# Altium schematic sheet Peripherals.SchDoc
size A3; Address1: ECE Department; Address2: University of Canterbury; Address3: Christchurch 8041; Address4: New Zealand; Revision: 1; SheetNumber: 2; SheetTotal: 3; ImagePath: \\maxwell\elecapp\AltiumDesigner\Templates\uc-logo.png
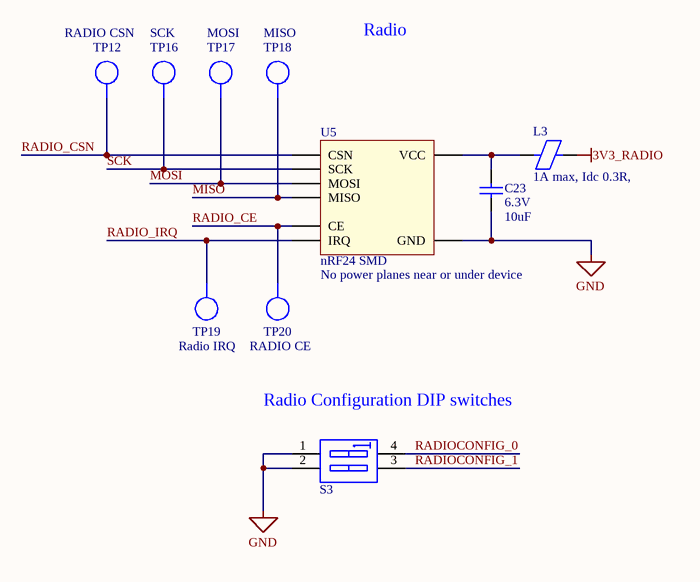
[diagram p0: Peripherals.SchDoc]

## Parts
C23  Voltage - Rated: 6.3V  [CAPC1608L]  (hidden comment: 10uF)
L3  1A max, Idc 0.3R,  [INDC3216L]
S3  WS_SW DIP-2  [DIP_SW_2WAY_SMD]  (value not drawn)
TP12  RADIO CSN  [TP_1206]  (no BOM)
TP16  SCK  [TP_1206]  (no BOM)
TP17  MOSI  [TP_1206]  (no BOM)
TP18  MISO  [TP_1206]  (no BOM)
TP19  Radio IRQ  [TP_1206]  (no BOM)
TP20  RADIO CE  [TP_1206]  (no BOM)
U5  nRF24 SMD  Warning: No power planes near or under device  [NRF24]

## Nets
3V3_RADIO: L3.2
GND: C23.1 S3.1(A1) S3.2(A2) U5.2(GND)
MISO: TP18.1 U5.7(MISO)
MOSI: TP17.1 U5.6(MOSI)
RADIO_CE: TP20.1 U5.3(CE)
RADIO_CSN: TP12.1 U5.4(CSN)
RADIO_IRQ: TP19.1 U5.8(IRQ)
RADIOCONFIG_0: S3.4(B1)
RADIOCONFIG_1: S3.3(B2)
SCK: TP16.1 U5.5(SCK)
NetC23_2: C23.2 L3.1 U5.1(VCC)

## Notes on the sheet
- Radio
- (near S3) Radio Configuration DIP switches
- Title
- Drawn by:
- Date:
- Time:
- Revision:
- Sheet
- of
- File:

## Library data of the parts
C23 = CC_10uF_0603: CAP CER 10UF X5R +-20% 6V3 0603; Supplier: ECE Dept; Storage Location: PCB Assembly WS; Value: 10uF
L3 = IN_Ferrite-Bead: Ferrite Bead, Rdc 0.3R, Z100MHZ 600R, Imax 1A, SMD 1206; Manufacturer: FAIR-RITE; Manufacturer PN: 2512066017Y1; DC Current Rating: 1; DC Resistance Max: 0.08; Ferrite Case Style: 1206 ^3216 Metric]; Frequency Range: 50MHz to 1; Impedance: 600; Impedance Tolerance: ± 25%; Supplier: ECE Dept; Storage Location: PCB Assembly WS; Ferrite Mounting: SMD; Supplier 1: Farnell; Supplier Part Number 1: 1612060; Manufacturer Part Number: 2512066017Y1; Value: 1A max, Idc 0.3R,
S3 = WS_SW DIP-2: DIP Switch, 2 Position, SPST SMD; Manufacturer: OMRON ELECTRONIC COMPONENTS; Manufacturer Part Number: A6SN-2101; Contact Current DC Max: 25; External Length / Height: 7; No. of Switch Positions: 2; Pitch Spacing: 2.54; PackageReference: DIP-4; Contact Configuration: SPST; Supplier 1: Farnell; Supplier Part Number 1: 2029424; Storage Location: PCB Assembly WS; Supplier: ECE Dept
TP12 TP16-TP20 = TP_1206: Test-Point 3.3x1.6x2.1mm SMD; Manufacturer: Harwin Inc; Manufacturer Part Number: S1751-46R; Value: TP; Manufacturer PN: *; Storage Location: ProtoPlace; Mounting Type: Surface Mount; Type: PC Test Point; Supplier 1: Digi-Key; Supplier Part Number 1: 952-1478-2-ND; Supplier 2: Farnell; Supplier Part Number 2: 1826282; Supplier: ECE Dept
U5 = NRF24: nRF24 SMD Module